# Altium schematic sheet CH32M030K8U7-R0.SchDoc
size A4; SheetNumber: 1; SheetTotal: 1
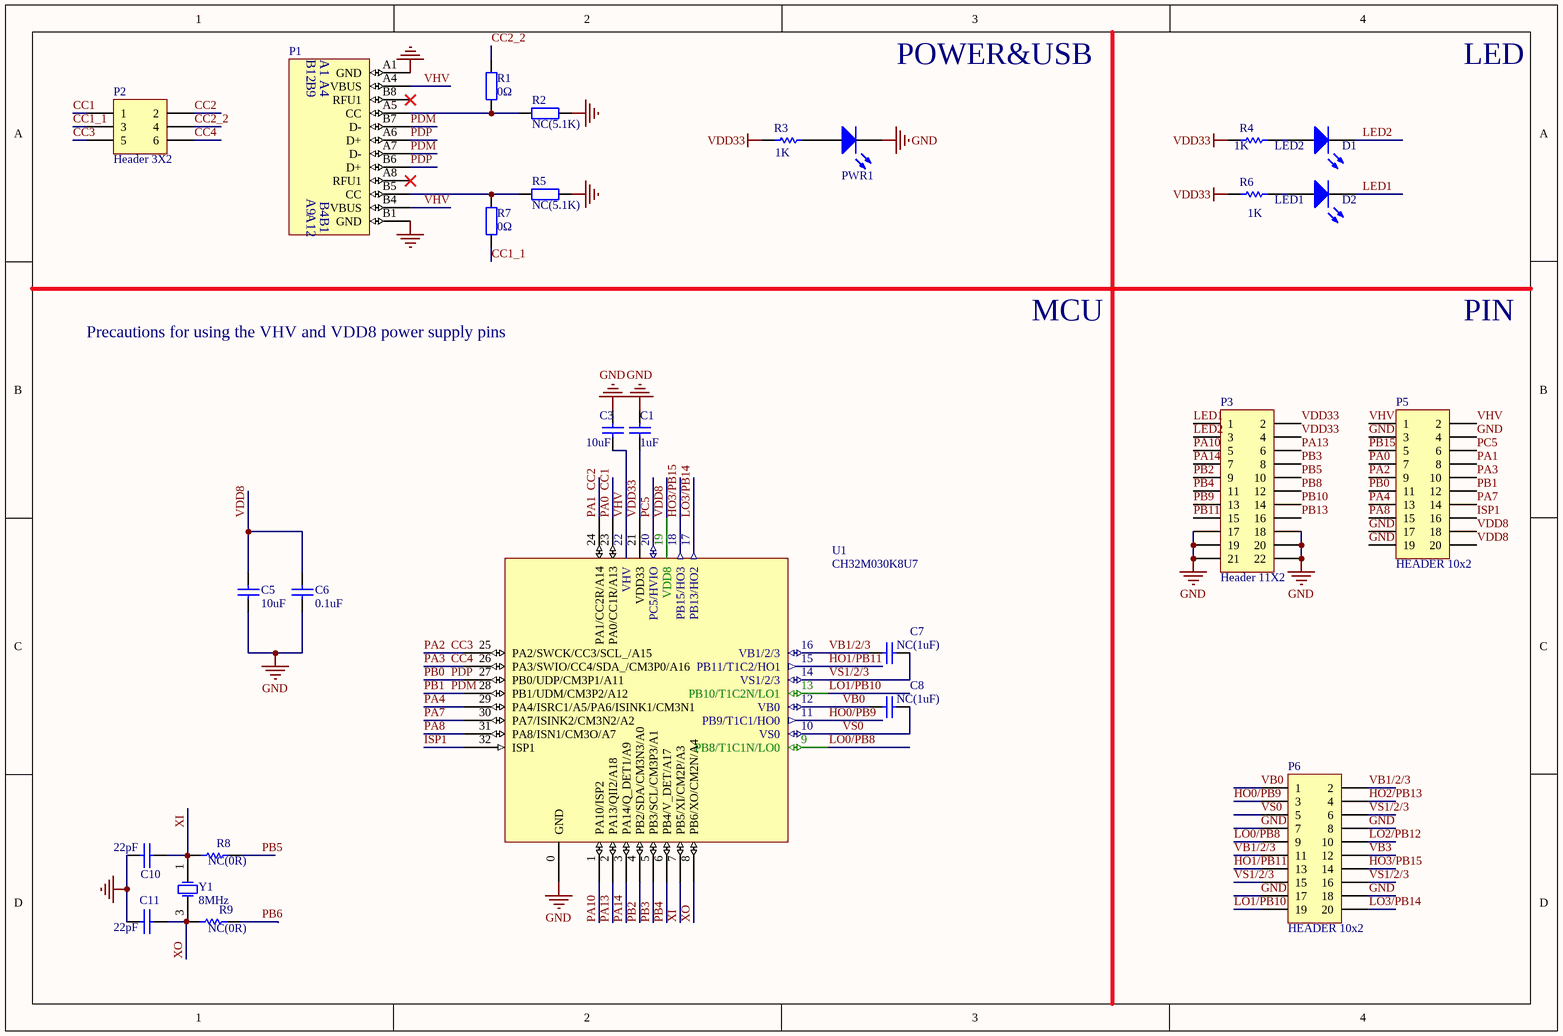
[diagram p0: CH32M030K8U7-R0.SchDoc]

## Parts
C1  1uF  [0603_C]
C3  10uF  [0603_C]
C5  10uF  [0603_C]
C6  0.1uF  [0603_C]
C7  NC(1uF)  [0603_C]
C8  NC(1uF)  [0603_C]
C10  22pF  [0603_C]
C11  22pF  [0603_C]
D1  LED2  [0603+]
D2  LED1  [0603+]
P1  TYPE-C  [TYPE-C-Receptacle-2.0]  (value not drawn)
P2  Header 3X2  [IDC6-2.54mm]
P3  Header 11X2  [IDC22-2.54mm]
P5  HEADER 10x2  [IDC20-2.54MM]
P6  HEADER 10x2  [IDC20-2.54MM]
PWR1  POWER  red  [0603+]  (value not drawn)
R1  0Ω  [0603]
R2  NC(5.1K)  [0603]
R3  1K  [0603]
R4  1K  [0603]
R5  NC(5.1K)  [0603]
R6  1K  [0603]
R7  0Ω  [0603]
R8  NC(0R)  [0603]
R9  NC(0R)  [0603]
U1  CH32M030K8U7  [QFN32_4X4]
Y1  8MHz  [XT3225]

## Nets
GND: C1.2 C3.2 C5.1 C6.1 C10.1 C11.1 P1.A1(GND) P1.B1(GND) P3.17 P3.18 P3.19 P3.20 P3.21 P3.22 P5.3 P5.4 P5.17 P5.19 P6.7 P6.8 P6.17 P6.18 PWR1.2(K) R2.2 R5.2 U1.0(GND)
VDD33: C1.1 P3.2 P3.4 R3.2 R4.1 R6.1 U1.21(VDD33)
CC1: P2.1 P5.7 U1.23(PA0/CC1R/A13)  [also labelled PA0]
CC1_1: P2.3 R7.1
CC2: P2.2 P5.8 U1.24(PA1/CC2R/A14)  [also labelled PA1]
CC2_2: P2.4 R1.2
CC3: P2.5 P5.9 U1.25(PA2/SWCK/CC3/SCL_/A15)  [also labelled PA2]
CC4: P2.6 P5.10 U1.26(PA3/SWIO/CC4/SDA_/CM3P0/A16)  [also labelled PA3]
HO0/PB9: P6.3 U1.11(PB9/T1C1/HO0)
HO1/PB11: P6.13 U1.15(PB11/T1C2/HO1)
HO2/PB13: P6.4
HO3/PB15: P6.14 U1.18(PB15/HO3)
ISP1: P5.16 U1.32(ISP1)
LED1: D2.2(K) P3.1
LED2: D1.2(K) P3.3
LO0/PB8: P6.9 U1.9(PB8/T1C1N/LO0)
LO1/PB10: P6.19 U1.13(PB10/T1C2N/LO1)
LO2/PB12: P6.10
LO3/PB14: P6.20 U1.17(PB13/HO2)
PA4: P5.13 U1.29(PA4/ISRC1/A5/PA6/ISINK1/CM3N1)
PA7: P5.14 U1.30(PA7/ISINK2/CM3N2/A2)
PA8: P5.15 U1.31(PA8/ISN1/CM3O/A7)
PA10: P3.5 U1.1(PA10/ISP2)
PA13: P3.6 U1.2(PA13/QII2/A18)
PA14: P3.7 U1.3(PA14/Q_DET1/A9)
PB0: P1.A6(D+) P1.B6(D+) P5.11 U1.27(PB0/UDP/CM3P1/A11)  [also labelled PDP]
PB1: P1.A7(D-) P1.B7(D-) P5.12 U1.28(PB1/UDM/CM3P2/A12)  [also labelled PDM]
PB2: P3.9 U1.4(PB2/SDA/CM3N3/A0)
PB3: P3.8 U1.5(PB3/SCL/CM3P3/A1)
PB4: P3.11 U1.6(PB4/V_DET/A17)
PB5: P3.10 R8.2
PB6: R9.2
PB8: P3.12
PB9: P3.13
PB10: P3.14
PB11: P3.15
PB13: P3.16
PB15: P5.5
PC5: P5.6 U1.20(PC5/HVIO)
VB0: C8.2 P6.1 U1.12(VB0)
VB1/2/3: C7.2 P6.2 P6.11 U1.16(VB1/2/3)
VB3: P6.12
VDD8: C5.2 C6.2 P5.18 P5.20 U1.19(VDD8)
VHV: C3.1 P1.A4(VBUS) P1.B4(VBUS) P5.1 P5.2 U1.22(VHV)
VS0: C8.1 P6.5 U1.10(VS0)
VS1/2/3: C7.1 P6.6 P6.15 P6.16 U1.14(VS1/2/3)
XI: C10.2 R8.1 U1.7(PB5/XI/CM2P/A3) Y1.1(OSC1)
XO: C11.2 R9.1 U1.8(PB6/XO/CM2N/A4)
NetD1_1: D1.1(A) R4.2
NetD2_1: D2.1(A) R6.2
NetP1_A5: P1.A5(CC) R1.1 R2.1
NetP1_B5: P1.B5(CC) R5.1 R7.2
NetPWR1_1: PWR1.1(A) R3.1

Not connected (* = marked no-connect by the designer): P1 A8(RFU1)* B8(RFU1)*; Y1 3(OSC2)

## Notes on the sheet
- POWER&USB
- LED
- Precautions for using the VHV and VDD8 power supply pins
- MCU
- PIN
- (in symbol TYPE-C1) B12; B9; A9; A12

## Library data of the parts
C1 C3 C5-C8 = Cap: Capacitor; Published: 8-Jun-2000; LatestRevisionDate: 17-Jul-2002; LatestRevisionNote: Re-released for DXP Platform.; PackageReference: RAD-0.3; Publisher: Altium Limited
C10 C11 = CAP: Capacitor
D1 D2 PWR1 = LED0: Typical INFRARED GaAs LED; Published: 8-Jun-2000; LatestRevisionDate: 08-Jul-2005; LatestRevisionNote: Mech Layer 1 removed.; PackageReference: LED-0; Publisher: Altium Limited
P1 = TYPE-C1
P2 = Header 3X2: Header, 3-Pin, Dual row; LatestRevisionDate: 17-Jul-2002; LatestRevisionNote: Re-released for DXP Platform.; Publisher: Altium Limited
P3 = Header 11X2: Header, 11-Pin, Dual row; LatestRevisionDate: 17-Jul-2002; LatestRevisionNote: Re-released for DXP Platform.; Publisher: Altium Limited
P5 P6 = HEADER 10x2: Header, 10-Pin, Dual row
R1 R2 R5 R7 = Res2: Resistor
R3 R4 R6 R8 R9 = Res Semi: Semiconductor Resistor; Published: 8-Jun-2000; LatestRevisionDate: 17-Jul-2002; LatestRevisionNote: Re-released for DXP Platform.; PackageReference: AXIAL-0.5; Publisher: Altium Limited
U1 = CH32M030K8U7: RISC-V MCU, 72MHz, USB, Type-C/PD, OPA, CMP, 28V gate driver
Y1 = XTAL: Crystal Oscillator; Published: 8-Jun-2000; LatestRevisionDate: 17-Jul-2002; LatestRevisionNote: Re-released for DXP Platform.; PackageReference: R38; Publisher: Altium Limited; PackageDescription: Crystal, Thru-Hole; 2 Leads; Body 3.1 x 8.2 mm (Dia.xH)